# Altium schematic sheet ШЮГИ.468262.004 Э3 Л1.SchDoc
size 430 x 307 mm; Author: Вшивцев; Organization: 322; Address1: 1; Address2: 2; DocumentNumber: ШЮГИ.468262.004 Э3; SheetNumber: 1; SheetTotal: 3; PP: ШЮГИ.468262.004; TypeD: Схема электрическая принципиальная; VA: КИА; Name: Логгер температурный
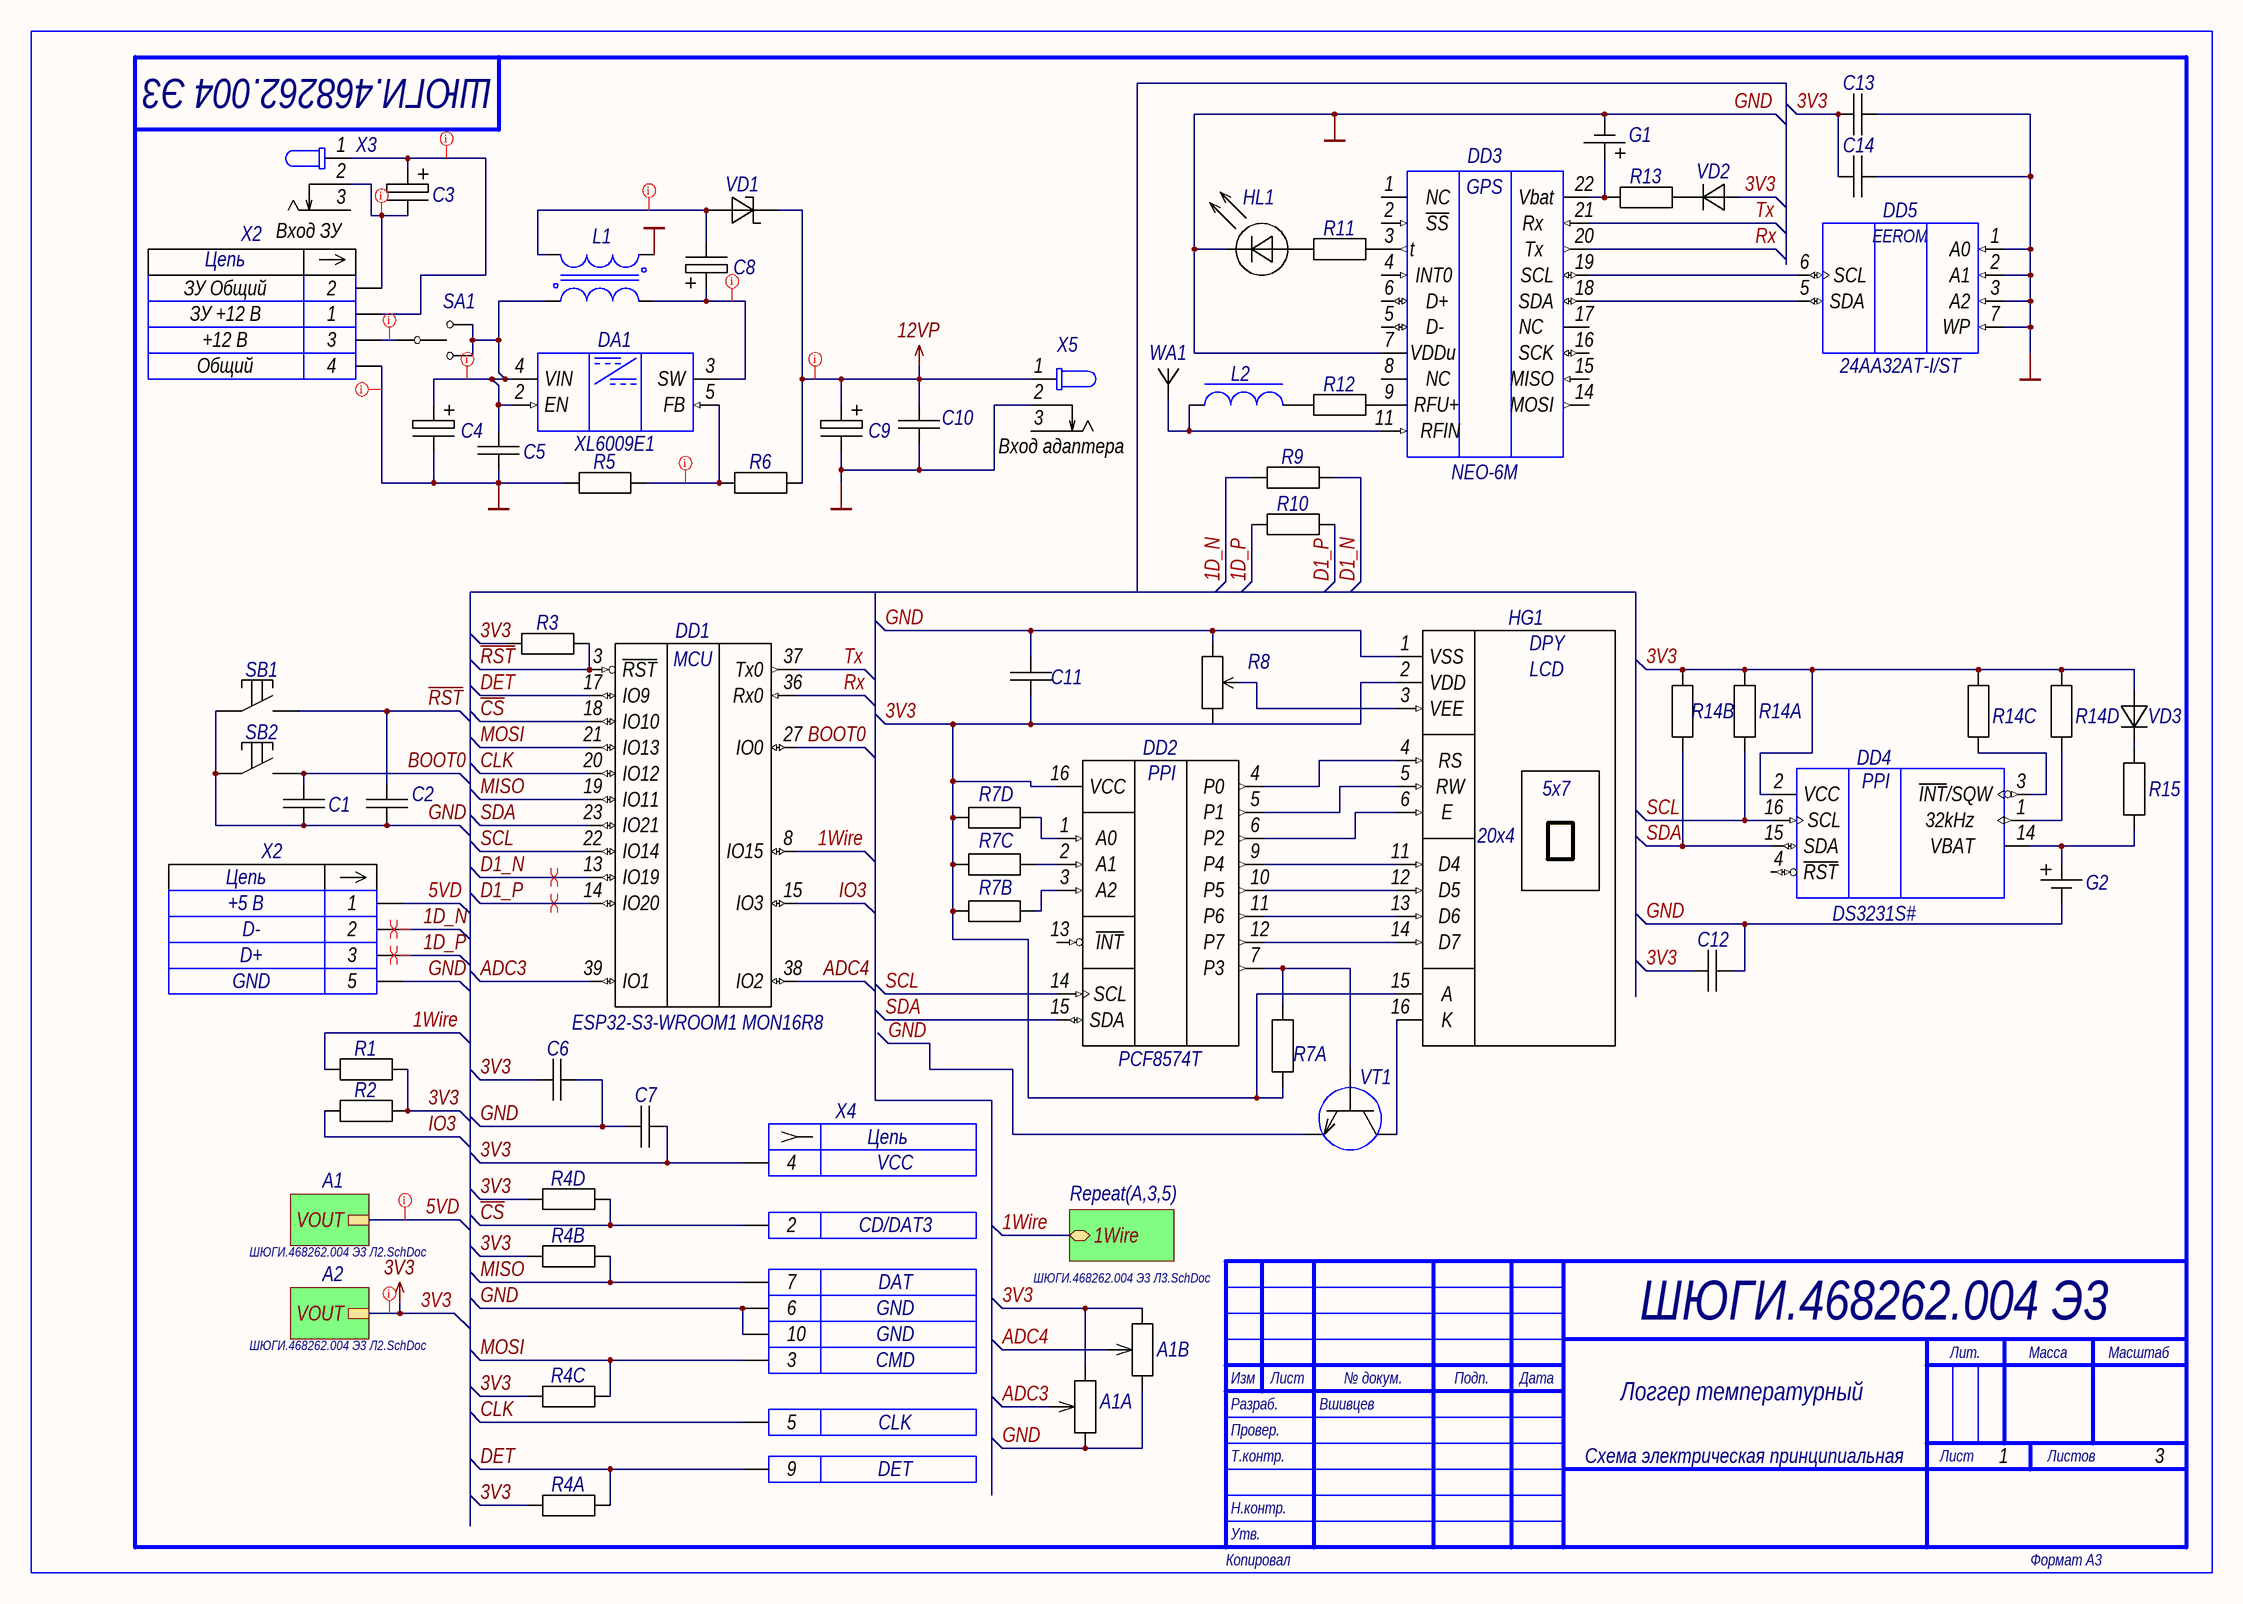
[diagram p0: ШЮГИ.468262.004 Э3 Л1.SchDoc]

## Parts
A1  KY-023 Aitewin Robot  [JOISTIK]  (value not drawn)  (parts A,B of 3)
C1  0603B104J500CT Thunder  [C0603]  (value not drawn)
C2  0603B104J500CT Thunder  [C0603]  (value not drawn)
C3  JCK1E100M050054 JB Capacitors  [AL5X54]  (value not drawn)
C4  JCK1E470M063054 JB Capacitors  [AL63X54]  (value not drawn)
C5  0603B104J500CT Thunder  [C0603]  (value not drawn)
C6  0603B104J500CT Thunder  [C0603]  (value not drawn)
C7  0603B104J500CT Thunder  [C0603]  (value not drawn)
C8  JCK1E220M063054 JB Capacitors  [AL63X54]  (value not drawn)
C9  JCK1C221M080105 JB Capacitors  [AL8X105]  (value not drawn)
C10  0603B104J500CT Thunder  [C0603]  (value not drawn)
C11  0603B104J500CT Thunder  [C0603]  (value not drawn)
C12  0603B104J500CT Thunder  [C0603]  (value not drawn)
C13  0603B104J500CT Thunder  [C0603]  (value not drawn)
C14  0603B104J500CT Thunder  [C0603]  (value not drawn)
DA1  XL6009E1  [TO-263-5]
DD1  ESP32-S3-WROOM1 MON16R8  [ESP32-S3-WROOM1]  (value not drawn)  (parts A,F,K,L,M,O,P,Q,R,S,T,U,Y,34,35,36,37 of 37)
DD2  PCF8574T  [SOIC16 (10.3)]
DD3  NEO-6M  [NEO-M8N]
DD4  DS3231S#  [SOIC16 (10.3)]
DD5  24AA32AT-I/ST  [TSOP8]
G1  KLS5-CR2032-01 KLS electronic co ltd  [KLS5-CR2032-01]  (value not drawn)
G2  KLS5-CR2032-01 KLS electronic co ltd  [KLS5-CR2032-01]  (value not drawn)
HG1  BCB2004-03-LW-SNMWD Blaze Display Technology  [LCD2004]  (value not drawn)
HL1  FYLS-0603GC Ningbo Foryard Optoelectronics  [L0603]  (value not drawn)
L1  7448991470 Würth Elektronik  [7448991220]  (value not drawn)
L2  LQM21DN220N00L Murata Electronics  [IND0805]  (value not drawn)
R1  Р1-12-0,063-10 кОм±2 %-Т-Л-М АБШК.434110.023 ТУ  [R0402]  (value not drawn)
R2  Р1-12-0,063-10 кОм±2 %-Т-Л-М АБШК.434110.023 ТУ  [R0402]  (value not drawn)
R3  Р1-12-0,063-10 кОм±2 %-Т-Л-М АБШК.434110.023 ТУ  [R0402]  (value not drawn)
R4  НР1-86-6-10 кОм±1 %-М-«А» ШКАБ.434110.039 ТУ  [НР1-86-6]  (value not drawn)  (parts A,B,C,D of 4)
R5  Р1-12-0,063-10 кОм±2 %-Т-Л-М АБШК.434110.023 ТУ  [R0402]  (value not drawn)
R6  Р1-12-0,063-86,6 кОм±2 %-Т-Л-М АБШК.434110.023 ТУ  [R0402]  (value not drawn)
R7  НР1-86-6-10 кОм±1 %-М-«А» ШКАБ.434110.039 ТУ  [НР1-86-6]  (value not drawn)  (parts A,B,C,D of 4)
R8  3362P-1-103LF Bourns  [3362P]  (value not drawn)
R9  Р1-12-0,063-22,1 Ом±2 %-Т-Л-М АБШК.434110.023 ТУ  [R0402]  (value not drawn)
R10  Р1-12-0,063-22,1 Ом±2 %-Т-Л-М АБШК.434110.023 ТУ  [R0402]  (value not drawn)
R11  Р1-12-0,063-1 кОм±2 %-Т-Л-М АБШК.434110.023 ТУ  [R0402]  (value not drawn)
R12  Р1-12-0,125-22,1 Ом±2 %-Т-Л-М АБШК.434110.023 ТУ  [R0805]  (value not drawn)
R13  Р1-12-0,063-1 кОм±2 %-Т-Л-М АБШК.434110.023 ТУ  [R0402]  (value not drawn)
R14  НР1-86-6-10 кОм±1 %-М-«А» ШКАБ.434110.039 ТУ  [НР1-86-6]  (value not drawn)  (parts A,B,C,D of 4)
R15  Р1-12-0,063-1 кОм±2 %-Т-Л-М АБШК.434110.023 ТУ  [R0402]  (value not drawn)
SA1  MTS-103-C3 Massuse Ltd.  [MTS-101-C3]  (value not drawn)
SB1  KLS7-TS3401-2.5-250-B KLS Electronics Co., Ltd.  [TS3401]  (value not drawn)
SB2  KLS7-TS3401-2.5-250-B KLS Electronics Co., Ltd.  [TS3401]  (value not drawn)
VD1  VS-50WQ03FN-M3 Vishay Intertechnology Inc.  [D-PAK 50WQ03]  (value not drawn)
VD2  LL4148 Diotec Semiconductor  [SOD80]  (value not drawn)
VD3  LL4148 Diotec Semiconductor  [SOD80]  (value not drawn)
VT1  BC847 NXP Semiconductors  [SOT-23-3]  (value not drawn)
WA1  U.FL-R-SMT-1 HIROSE ELECTRIC CO., LTD.  [U.FL-R-SMT-1]  (value not drawn)
X1  DS1069-4MRW6XB Connfly electronic  [CWF-4R]  (value not drawn)  (parts A,B,C,D of 4)
X2  1050017-0001  [MICRO USB]  (value not drawn)  (parts A,B,C,E of 5)
X3  DS-261A-PA9T-NB-210 Dragon City Industries  [DS-261]  (value not drawn)
X4  TFP09-2-12B  [TFP09212B]  (value not drawn)  (parts B,C,D,E,F,G,I,J of 10)
X5  DS-261A-PA9T-NB-210 Dragon City Industries  [DS-261]  (value not drawn)

## Sub-sheets
A1 = ШЮГИ.468262.004 Э3 Л2.SchDoc: VOUT
A2 = ШЮГИ.468262.004 Э3 Л2.SchDoc: VOUT
Repeat(A,3,5) = ШЮГИ.468262.004 Э3 Л3.SchDoc: 1Wire (bidir)

## Nets
3V3: A1.1(1') A1.1' C6.1 C7.2 C11.2 C12.1 C13.1 C14.1 DD1.2(VCC) DD2.16(VCC) DD3.23(VCC) DD4.2(VCC) DD5.8(VCC) HG1.2(VDD) HG1.15(A) R1.2 R2.2 R3.1(+) R4.1(+) R4.2(+) R4.3(+) R4.4(+) R7.1(+) R7.2(+) R7.3(+) R7.4(+) R8.3 R14.1(+) R14.2(+) R14.3(+) R14.4(+) VD2.1(AN) VD3.1(AN) X4.4 ; sheet A2/VOUT
12VP: C9.1(+) C10.1 R6.2 VD1.2(CT) X5.1
GND: A1.3(3') A1.3' C1.2 C2.2 C4.2 C5.2 C6.2 C7.1 C9.2 C10.2 C11.1 C12.2 C13.2 C14.2 DA1.1(GND) DD1.1(GND) DD1.40(GND) DD1.41(GND) DD2.8(GND) DD3.7(VDDu) DD3.10(GND) DD3.12(GND) DD3.13(GND) DD3.24(GND) DD4.5(nc) DD4.6(nc) DD4.7(nc) DD4.8(nc) DD4.9(nc) DD4.10(nc) DD4.11(nc) DD4.12(nc) DD4.13(GND) DD5.1(A0) DD5.2(A1) DD5.3(A2) DD5.4(GND) DD5.7(WP) G1.1(GND) G2.1(GND) HG1.1(VSS) HL1.2(CAT) L1.1 R5.1(+) R8.1(+) SB1.1 SB2.1 VT1.2(Э) WA1.0(GND) X1.4 X2.5 X4.6 X4.10 X5.2
1D_N: R9.1(+) X2.2
1D_P: R10.1(+) X2.3
1Wire: DD1.8(IO15) R1.1(+) ; sheet Repeat(A,3,5)/1Wire
5VD: X2.1 ; sheet A1/VOUT
ADC3: A1.2' DD1.39(IO1)
ADC4: A1.2(2') DD1.38(IO2)
BOOT0: C1.1 DD1.27(IO0) SB2.2
~{CS}: DD1.18(IO10) R4.5 X4.2
CLK: DD1.20(IO12) X4.5
D1_N: DD1.13(IO19) R9.2
D1_P: DD1.14(IO20) R10.2
DET: DD1.17(IO9) R4.8 X4.9
IO3: DD1.15(IO3) R2.1(+)
MISO: DD1.19(IO11) R4.7 X4.7
MOSI: DD1.21(IO13) R4.6 X4.3
~{RST}: C2.1 DD1.3(~{RST}) R3.2 SB1.2
Rx: DD1.36(Rx0) DD3.20(Tx)
SCL: DD1.22(IO14) DD2.14(SCL) DD4.16(SCL) R14.8
SDA: DD1.23(IO21) DD2.15(SDA) DD4.15(SDA) R14.7
Tx: DD1.37(Tx0) DD3.21(Rx)
NetC3_1: C3.1(+) X1.1 X3.1
NetC3_2: C3.2 X1.2 X3.2
NetC4_1: C4.1(+) C5.1 DA1.2(EN) DA1.4(VIN) L1.3 SA1.1 SA1.3
NetC8_1: C8.1(+) DA1.3(SW) L1.4
NetC8_2: C8.2 L1.2 VD1.1(AN)
NetDA1_5: DA1.5(FB) R5.2 R6.1(+)
NetDD2_1: DD2.1(A0) R7.5
NetDD2_2: DD2.2(A1) R7.6
NetDD2_3: DD2.3(A2) R7.7
NetDD2_4: DD2.4(P0) HG1.4(RS)
NetDD2_5: DD2.5(P1) HG1.5(RW)
NetDD2_6: DD2.6(P2) HG1.6(E)
NetDD2_7: DD2.7(P3) R7.8 VT1.1(Б)
NetDD2_9: DD2.9(P4) HG1.11(D4)
NetDD2_10: DD2.10(P5) HG1.12(D5)
NetDD2_11: DD2.11(P6) HG1.13(D6)
NetDD2_12: DD2.12(P7) HG1.14(D7)
NetDD3_3: DD3.3(t) R11.2
NetDD3_9: DD3.9(RFU+) R12.2
NetDD3_11: DD3.11(RFIN) L2.1 WA1.1
NetDD3_18: DD3.18(SDA) DD5.5(SDA)
NetDD3_19: DD3.19(SCL) DD5.6(SCL)
NetDD3_22: DD3.22(Vbat) G1.2(VCC) R13.1(+)
NetDD4_1: DD4.1(32kHz) R14.5
NetDD4_3: DD4.3(~{INT}/SQW) R14.6
NetDD4_14: DD4.14(VBAT) G2.2(VCC) R15.2
NetHG1_3: HG1.3(VEE) R8.2
NetHG1_16: HG1.16(K) VT1.3(К)
NetHL1_1: HL1.1(AN) R11.1(+)
NetL2_2: L2.2 R12.1(+)
NetR13_2: R13.2 VD2.2(CT)
NetR15_1: R15.1(+) VD3.2(CT)
NetSA1_2: SA1.2 X1.3

Not connected (* = marked no-connect by the designer): DD2 13(~{INT}); DD3 1(NC) 2(~{SS}) 4(INT0) 5(D-) 6(D+) 8(NC) 14(MOSI) 15(MISO) 16(SCK) 17(NC); DD4 4(~{RST}); X3 3; X5 3

## Layout directives
differential pair: 1D_N, 1D_P, D1_N, D1_P
net class PWR: 3V3, 5VD, 12VP, GND, NetC3_1, NetC3_2, NetC4_1, NetC8_1, NetC8_2, NetDA1_5, NetSA1_2

## Notes on the sheet
- X2
- (near X3) Вход ЗУ
- Цепь
- ЗУ Общий
- ЗУ +12 В
- +12 В
- Общий
- (near X5) Вход адаптера
- DD1
- MCU
- +5 В
- (near C1) X2
- D-
- D+
- GND
- (near DD1) ESP32-S3-WROOM1 MON16R8
- X4
- VCC
- CD/DAT3
- DAT
- CMD
- CLK
- DET
- Лит.
- Масса
- Масштаб
- Разраб.
- Провер.
- Изм
- Лист
- № докум.
- Подп.
- Дата
- Т.контр.
- Листов
- Копировал
- Утв.
- Н.контр.
- Формат А3
- (in symbol 24AA32AT-I/ST) EEROM
- (in symbol BCB2004-03-LW-SNMWD) DPY; LCD; 5x7; 20х4
- (in symbol DS3231S#) PPI
- (in symbol NEO-6M) GPS
- (in symbol PCF8574T) PPI

## Library data of the parts
A1 = KY-023: ТИП: Устройтсво; Part Number: KY-023; ValueSCH: KY-023; ValueBOM: KY-023 Aitewin Robot; ГОСТ: Aitewin Robot
C1 C2 C5-C7 C10-C14 = 0603B104J500CT: ТИП: Конденсатор; Value: 0,1 uF; Power: 50 V; Perk: ±5 %; Mark: 104; Диэлектрик: X7R; Part Number: 0603B104J500CT; ValueBOM: 0603B104J500CT Thunder; ValueSCH: 0603B104J500CT; ГОСТ: Thunder
C3 = JCK1E100M050054: ТИП: Конденсатор; Value: 10 uF; Power: 25 V; Mark: 100; Part Number: JCK1E100M050054; ValueBOM: JCK1E100M050054 JB Capacitors; ValueSCH: JCK1E100M050054; ГОСТ: JB Capacitors
C4 = JCK1E470M063054: ТИП: Конденсатор; Value: 47 uF; Power: 25 V; Mark: 470; Part Number: JCK1E470M063054; ValueBOM: JCK1E470M063054 JB Capacitors; ValueSCH: JCK1E470M063054; ГОСТ: JB Capacitors
C8 = JCK1E220M063054: ТИП: Конденсатор; Value: 22 uF; Power: 25 V; Mark: 220; Part Number: JCK1E220M063054; ValueBOM: JCK1E220M063054 JB Capacitors; ValueSCH: JCK1E220M063054; ГОСТ: JB Capacitors
C9 = JCK1C221M080105: ТИП: Конденсатор; Value: 220 uF; Power: 16 V; Mark: 221; Part Number: JCK1C221M080105; ValueBOM: JCK1C221M080105 JB Capacitors; ValueSCH: JCK1C221M080105; ГОСТ: JB Capacitors
DA1 = XL6009E1: ValueBOM: XL6009E1 Shanghai Xinlong Semiconductor Technology Co., Ltd; ГОСТ: Shanghai Xinlong Semiconductor Technology Co., Ltd; Part Number: XL6009E1; ValueSCH: XL6009E1
DD1 = ESP32-S3-WROOM1 MON16R8: ValueBOM: ESP32-S3-WROOM1 MON16R8 Espressif; ГОСТ: Espressif; ТИП: Микросхема; Part Number: ESP32-S3-WROOM1 MON16R8; ValueSCH: ESP32-S3-WROOM1 MON16R8
DD2 = PCF8574T: I2C расширитель портов ввода/вывода PCF8574; ValueBOM: PCF8574T Philips Semiconductors; ГОСТ: Philips Semiconductors; ТИП: Микросхема; Part Number: PCF8574T; ValueSCH: PCF8574T; Интерфейс: I2C
DD3 = NEO-6M: ValueBOM: NEO-6M U-Blox; ГОСТ: U-Blox; ТИП: Микросхема; Интерфейс: UART; Part Number: NEO-6M; ValueSCH: NEO-6M
DD4 = DS3231S#: ValueBOM: DS3231S# Maxim Integrated Products; ГОСТ: Maxim Integrated Products; ТИП: Микросхема; Интерфейс: I2C; Part Number: DS3231S#; ValueSCH: DS3231S#
DD5 = 24AA32AT-I/ST: ValueBOM: 24AA32AT-I/ST Microchip Technology; ГОСТ: Microchip Technology; ТИП: Микросхема; Интерфейс: I2C; Part Number: 24AA32AT-I/ST; ValueSCH: 24AA32AT-I/ST
G1 G2 = KLS5-CR2032-01: ТИП: Батарейка; Part Number: KLS5-CR2032-01; ValueSCH: KLS5-CR2032-01; ValueBOM: KLS5-CR2032-01 KLS electronic co ltd; ГОСТ: KLS electronic co ltd
HG1 = BCB2004-03-LW-SNMWD: ЖКИ 20*4 англо-русский WH2004A-YGH-CT(K); ТИП: Оптоэлектроника; Part Number: BCB2004-03-LW-SNMWD; ValueSCH: BCB2004-03-LW-SNMWD; ValueBOM: BCB2004-03-LW-SNMWD Blaze Display Technology; ГОСТ: Blaze Display Technology
HL1 = FYLS-0603GC: ТИП: Светодиод; If mA: 12; Vf V: 2; Цвет: Зеленый; Part Number: FYLS-0603GC; ValueSCH: FYLS-0603GC; ValueBOM: FYLS-0603GC Ningbo Foryard Optoelectronics; ГОСТ: Ningbo Foryard Optoelectronics
L1 = 7448991470: ТИП: Дроссель связный; Value: 47 uH; Perk: 0,2; Current A: 1,5; Part Number: 7448991470; ValueSCH: 7448991470; ValueBOM: 7448991470 Würth Elektronik; ГОСТ: Würth Elektronik
L2 = LQM21DN220N00L: ТИП: Дроссель; Value: 22 uH; Part Number: LQM21DN220N00L; ValueSCH: LQM21DN220N00L; ValueBOM: LQM21DN220N00L Murata Electronics; ГОСТ: Murata Electronics
R1-R3 R5 = Р1-12-0,063-10 кОм±2 %-Т-Л-М: ТИП: Резистор; Value: 10 кОм; Power: 0,063; Perk: ±2 %; Part Number: Р1-12-0,063-10 кОм±2 %-Т-Л-М; ValueBOM: Р1-12-0,063-10 кОм±2 %-Т-Л-М АБШК.434110.023 ТУ; ValueSCH: Р1-12-0,063-10 кОм±2 %-Т-Л-М; ГОСТ: АБШК.434110.023 ТУ
R4 R7 R14 = НР1-86-6-10 кОм±1 %-М-«А»: ТИП: Резистор; Value: 10 кОм; Power: 0,0625 Вт; Perk: ±1 %; Part Number: НР1-86-6-10 кОм±1 %-М-«А»; ValueBOM: НР1-86-6-10 кОм±1 %-М-«А» ШКАБ.434110.039 ТУ; ValueSCH: НР1-86-6-10 кОм±1 %-М-«А»; ГОСТ: ШКАБ.434110.039 ТУ
R6 = Р1-12-0,063-86,6 кОм±2 %-Т-Л-М: ТИП: Резистор; Power: 0,063; Perk: ±2 %; Part Number: Р1-12-0,063-86,6 кОм±2 %-Т-Л-М; ValueBOM: Р1-12-0,063-86,6 кОм±2 %-Т-Л-М АБШК.434110.023 ТУ; ValueSCH: Р1-12-0,063-86,6 кОм±2 %-Т-Л-М; ГОСТ: АБШК.434110.023 ТУ; Value: 86,6 кОм
R8 = 3362P-1-103LF: Value: 10 кОм; ТИП: Резистор; Part Number: 3362P-1-103LF; ValueSCH: 3362P-1-103LF; ValueBOM: 3362P-1-103LF Bourns; ГОСТ: Bourns
R9 R10 = Р1-12-0,063-22,1 Ом±2 %-Т-Л-М: ТИП: Резистор; Value: 22,1 Ом; Power: 0,063; Perk: ±2 %; Part Number: Р1-12-0,063-22,1 Ом±2 %-Т-Л-М; ValueBOM: Р1-12-0,063-22,1 Ом±2 %-Т-Л-М АБШК.434110.023 ТУ; ValueSCH: Р1-12-0,063-22,1 Ом±2 %-Т-Л-М; ГОСТ: АБШК.434110.023 ТУ
R11 R13 R15 = Р1-12-0,063-1 кОм±2 %-Т-Л-М: ТИП: Резистор; Value: 1 кОм; Power: 0,063; Perk: ±2 %; Part Number: Р1-12-0,063-1 кОм±2 %-Т-Л-М; ValueBOM: Р1-12-0,063-1 кОм±2 %-Т-Л-М АБШК.434110.023 ТУ; ValueSCH: Р1-12-0,063-1 кОм±2 %-Т-Л-М; ГОСТ: АБШК.434110.023 ТУ
R12 = Р1-12-0,125-22,1 Ом±2 %-Т-Л-М: ТИП: Резистор; Value: 22,1 Ом; Power: 0,125; Perk: ±2 %; Part Number: Р1-12-0,125-22,1 Ом±2 %-Т-Л-М; ValueBOM: Р1-12-0,125-22,1 Ом±2 %-Т-Л-М АБШК.434110.023 ТУ; ValueSCH: Р1-12-0,125-22,1 Ом±2 %-Т-Л-М; ГОСТ: АБШК.434110.023 ТУ
SA1 = MTS-103-C3: ТИП: переключатель; Part Number: MTS-103-C3; ValueSCH: MTS-103-C3; ValueBOM: MTS-103-C3 Massuse Ltd.; ГОСТ: Massuse Ltd.
SB1 SB2 = KLS7-TS3401-2.5-250-B: ТИП: Тактовая кнопка; Part Number: KLS7-TS3401-2.5-250-B; ValueSCH: KLS7-TS3401-2.5-250-B; ValueBOM: KLS7-TS3401-2.5-250-B KLS Electronics Co., Ltd.; ГОСТ: KLS Electronics Co., Ltd.
VD1 = VS-50WQ03FN-M3: Диод Шоттки; Ur: 30; Uf: 0,35; Part Number: VS-50WQ03FN-M3; ValueSCH: VS-50WQ03FN-M3; ValueBOM: VS-50WQ03FN-M3 Vishay Intertechnology Inc.; ГОСТ: Vishay Intertechnology Inc.; ТИП: Диод Шоттки
VD2 VD3 = LL4148: Выпрямительный диод; Uобр: 75; Uпр: 1; Part Number: LL4148; ValueSCH: LL4148; ValueBOM: LL4148 Diotec Semiconductor; ГОСТ: Diotec Semiconductor; ТИП: Диод
VT1 = BC847: ТИП: Транзистор; Uкэ: 45; Uкб: 50; Uэб: 6; Part Number: BC847; ValueSCH: BC847; ValueBOM: BC847 NXP Semiconductors; ГОСТ: NXP Semiconductors
WA1 = U.FL-R-SMT-1: ТИП: Соединитель; Part Number: U.FL-R-SMT-1; ValueSCH: U.FL-R-SMT-1; ValueBOM: U.FL-R-SMT-1 HIROSE ELECTRIC CO., LTD.; ГОСТ: HIROSE ELECTRIC CO., LTD.
X1 = DS1069-4MRW6XB: System: Connector; ТИП: Разъем; Library Reference: Вилка 4 кп; ValueBOM: DS1069-4MRW6XB Connfly electronic; ValueSCH: DS1069-4MRW6XB; ГОСТ: Connfly electronic; Part Number: DS1069-4MRW6XB; Component Kind: Standard; Component Type: Standard; Pin Count: 4
X2 = 1050017-0001: ValueBOM: 1050017-0001 Molex; ГОСТ: Molex; ТИП: Соединитель; Part Number: 1050017-0001; ValueSCH: 1050017-0001
X3 X5 = DS-261A-PA9T-NB-210: System: Connector; ТИП: Разъем; Library Reference: адаптер питания; ValueBOM: DS-261A-PA9T-NB-210 Dragon City Industries; ValueSCH: DS-261A-PA9T-NB-210; ГОСТ: Dragon City Industries; Part Number: DS-261A-PA9T-NB-210; Component Kind: Standard; Component Type: Standard; Pin Count: 3
X4 = TFP09-2-12B: ValueBOM: TFP09-2-12B Shenzhen Chipskey Technology Co., Ltd.; ГОСТ: Shenzhen Chipskey Technology Co., Ltd.; ТИП: Соединитель; Part Number: TFP09-2-12B; ValueSCH: TFP09-2-12B